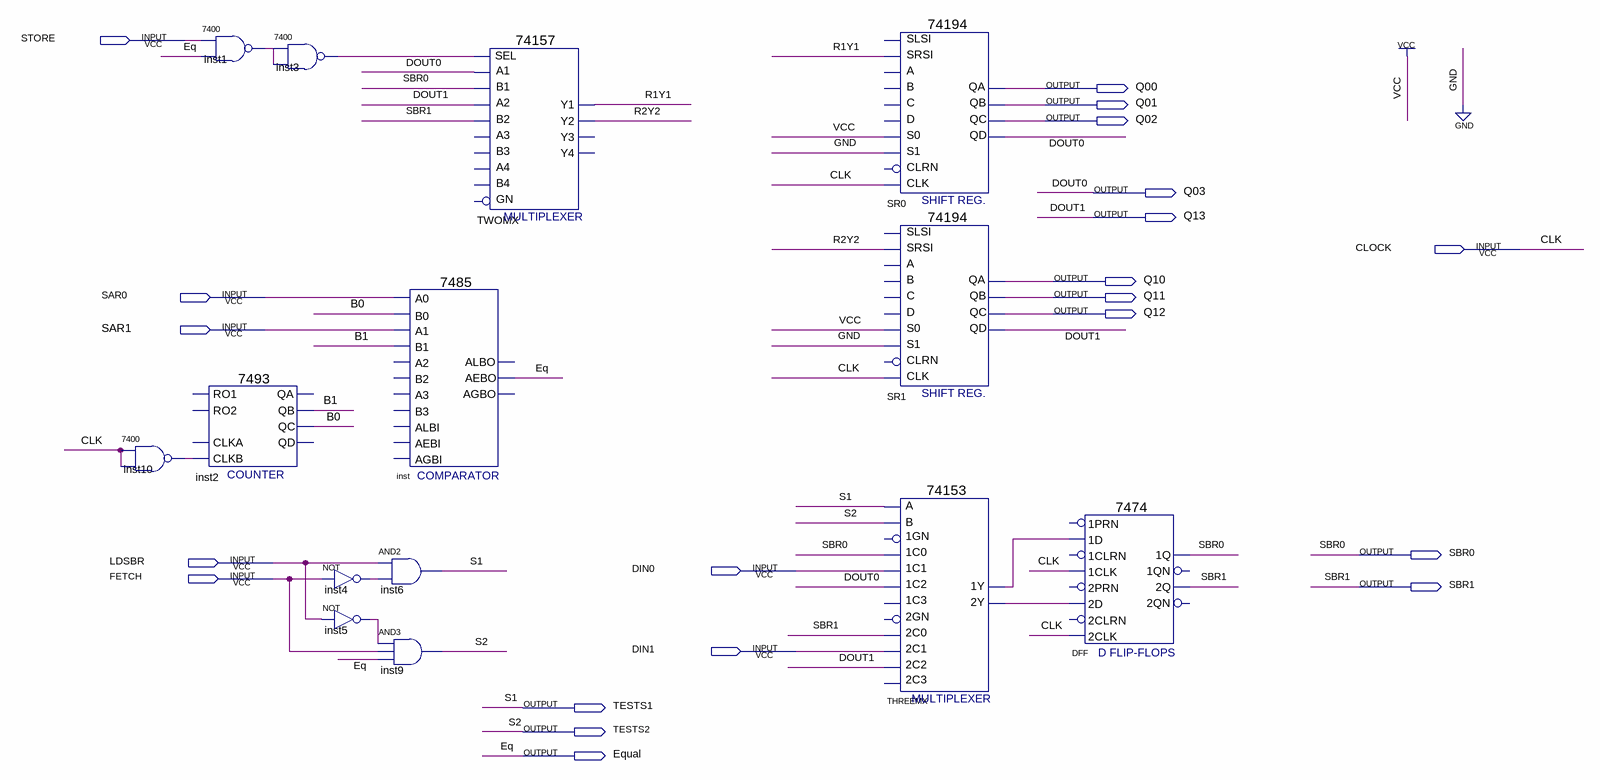
[diagram p0: schematic sheet]
// Quartus schematic Lab2.bdf as structural Verilog: 14 symbols, 21 pins
module Lab2 (
  input  STORE,
  input  CLOCK,
  input  SAR0,
  input  SAR1,
  input  LDSBR,
  input  DIN0,
  input  FETCH,
  input  DIN1,
  output Q00,
  output Q01,
  output Q02,
  output Q03,
  output Q13,
  output Q10,
  output Q11,
  output Q12,
  output SBR0,
  output SBR1,
  output TESTS1,
  output TESTS2,
  output Equal
);

  wire B0, B1, inst1_1, inst3_1, inst4_out, inst5_out, inst10_1, R1Y1, R2Y2, THREEMX_1y, THREEMX_2y;

  \7400  inst10 (.\3 (CLOCK), .\2 (CLOCK), .\1 (inst10_1));
  \7400  inst1 (.\3 (Equal), .\2 (STORE), .\1 (inst1_1));
  \7493  inst2 (.CLKB(inst10_1), .QC(B0), .QB(B1));  // open: RO1, RO2, CLKA, QA, QD
  \7400  inst3 (.\3 (inst1_1), .\2 (inst1_1), .\1 (inst3_1));
  not inst4 (inst4_out, FETCH);
  not inst5 (inst5_out, LDSBR);
  \7485  inst (
    .A0(SAR0), .B0(B0), .A1(SAR1), .B1(B1), .AEBO(Equal));  // open: A3, B2, A2, AEBI, AGBI, ALBI, B3, ALBO, AGBO
  and inst6 (TESTS1, LDSBR, inst4_out);
  and inst9 (TESTS2, inst5_out, FETCH, Equal);
  \74157  TWOMX (
    .A1(Q03), .B1(SBR0), .SEL(inst3_1), .B2(SBR1), .A2(Q13), .Y2(R2Y2), .Y1(R1Y1));  // open: A3, B3, B4, GN, A4, Y4, Y3
  \74194  SR0 (
    .SRSI(R1Y1), .CLK(CLOCK), .S1(1'b0), .S0(1'b1), .QA(Q00), .QB(Q01), .QC(Q02), .QD(Q03));  // open: SLSI, B, C, CLRN, D, A
  \74194  SR1 (
    .SRSI(R2Y2), .CLK(CLOCK), .S1(1'b0), .S0(1'b1), .QA(Q10), .QB(Q11), .QC(Q12), .QD(Q13));  // open: SLSI, B, C, CLRN, D, A
  \74153  THREEMX (
    .\1C1 (DIN0), .\1C0 (SBR0), .\2C0 (SBR1), .\2C2 (Q13), .\1C2 (Q03), .B(TESTS2), .A(TESTS1), .\2C1 (DIN1),
    .\1Y (THREEMX_1y), .\2Y (THREEMX_2y));  // open: 1GN, 2GN, 1C3, 2C3
  \7474  DFF (
    .\2D (THREEMX_2y), .\1CLK (CLOCK), .\1D (THREEMX_1y), .\2CLK (CLOCK), .\2Q (SBR1), .\1Q (SBR0));  // open: 2PRN, 1PRN, 2CLRN, 1CLRN, 1QN, 2QN

  // Other names for the same wires on the sheet: CLK = CLOCK; DOUT0 = Q03; DOUT1 = Q13; Eq = Equal; S1 = TESTS1;
  //   S2 = TESTS2
endmodule
